# Altium schematic sheet M4QIDB-SCH-01 Master.SchDoc: <page title>
size Letter; Author: <XXX>; Organization: Engenuics Technologies Inc; Address1: 88 Dalhurst Way NW; Address2: CALGARY AB; Address3: CANADA T3A 1N7; Address4: 1-888-912-3451; DocumentNumber: <PPPP-DTTT->; Revision: <###>; SheetNumber: <x>; SheetTotal: <y>
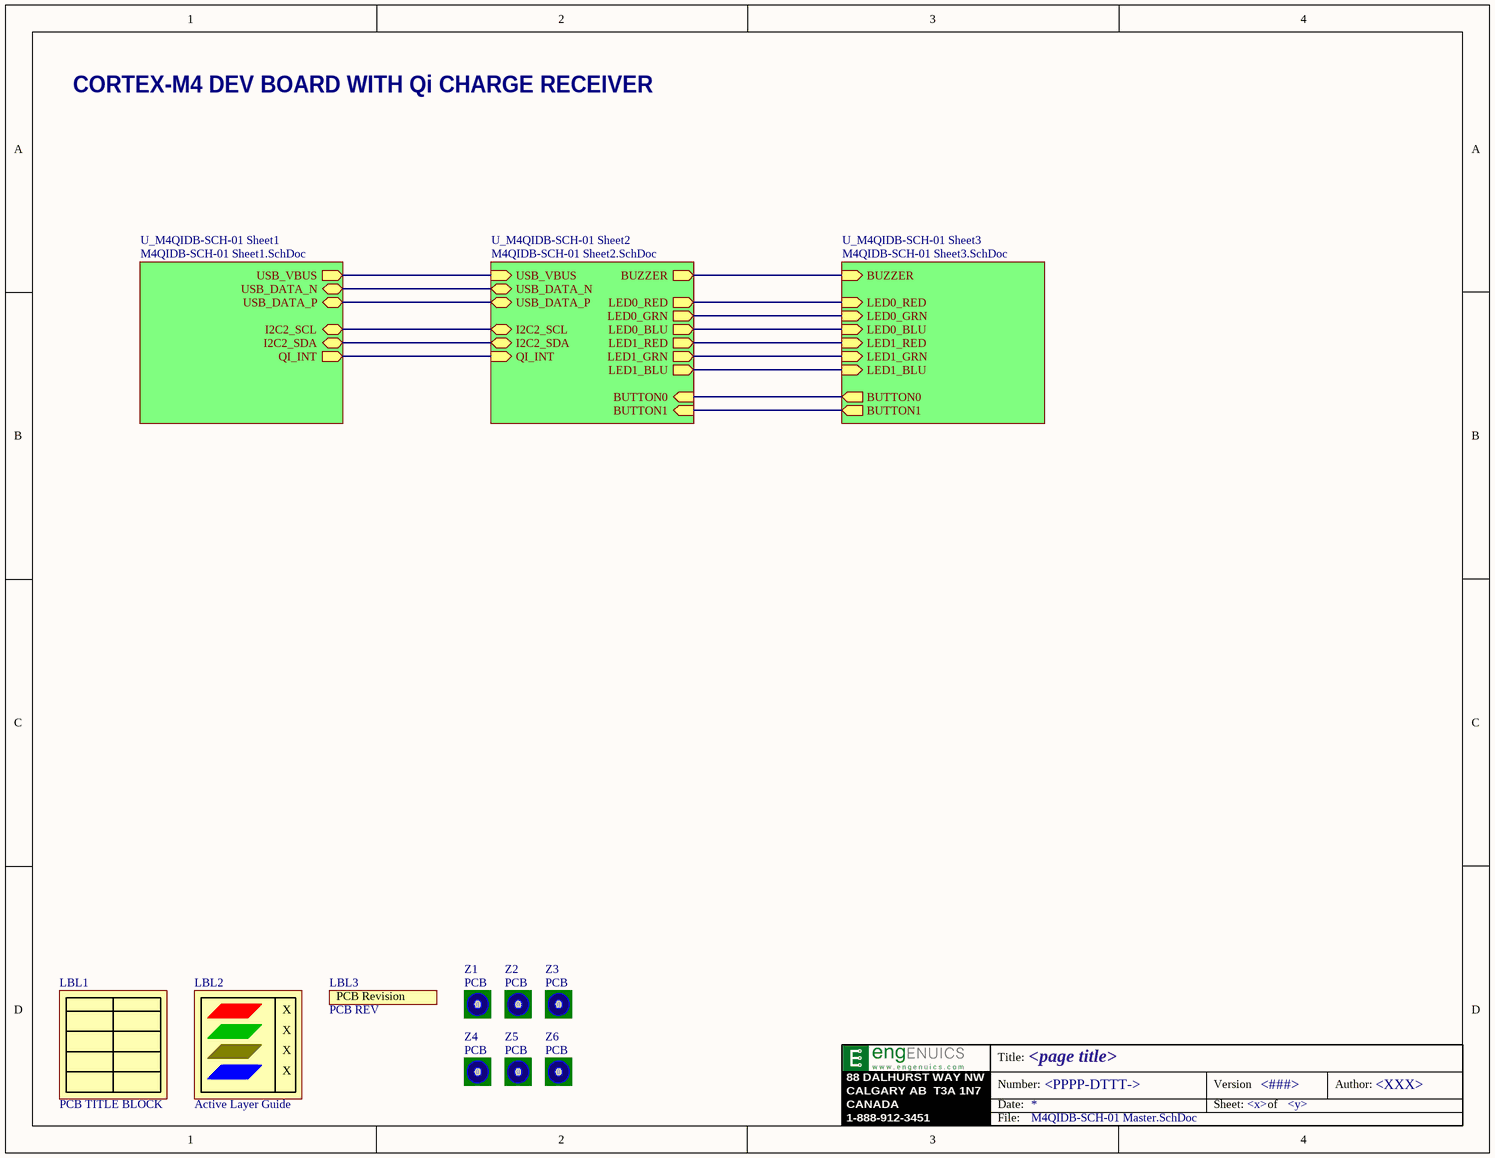
[diagram p0: M4QIDB-SCH-01 Master.SchDoc]

## Parts
LBL1  PCB TITLE BLOCK  [LABEL PCB Title Block]  (no BOM)
LBL2  Active Layer Guide  [LABEL PCB ACTIVE LAYERS VERTICAL]  (no BOM)
LBL3  PCB REV  [LABEL PCB REVISION]  (no BOM)
Z1  PCB  [FIDUCIAL PCB]  (no BOM)
Z2  PCB  [FIDUCIAL PCB]  (no BOM)
Z3  PCB  [FIDUCIAL PCB]  (no BOM)
Z4  PCB  [FIDUCIAL PCB]  (no BOM)
Z5  PCB  [FIDUCIAL PCB]  (no BOM)
Z6  PCB  [FIDUCIAL PCB]  (no BOM)

## Sub-sheets
U_M4QIDB-SCH-01 Sheet1 = M4QIDB-SCH-01 Sheet1.SchDoc: USB_DATA_N (bidir), USB_DATA_P (bidir), USB_VBUS (out), I2C2_SCL (bidir), I2C2_SDA (bidir), QI_INT (out)
U_M4QIDB-SCH-01 Sheet2 = M4QIDB-SCH-01 Sheet2.SchDoc: USB_DATA_N (bidir), USB_DATA_P (bidir), USB_VBUS (in), BUZZER (out), BUTTON0 (in), BUTTON1 (in), LED0_RED (out), LED1_RED (out), LED0_BLU (out), LED1_BLU (out), LED0_GRN (out), LED1_GRN (out), I2C2_SCL (bidir), I2C2_SDA (bidir), QI_INT (in)
U_M4QIDB-SCH-01 Sheet3 = M4QIDB-SCH-01 Sheet3.SchDoc: BUTTON1 (out), BUTTON0 (out), LED0_RED (in), LED1_RED (in), LED0_BLU (in), LED1_BLU (in), LED0_GRN (in), LED1_GRN (in), BUZZER (in)

## Nets
(unnamed): sheet U_M4QIDB-SCH-01 Sheet1/USB_DATA_N, sheet U_M4QIDB-SCH-01 Sheet2/USB_DATA_N
(unnamed): sheet U_M4QIDB-SCH-01 Sheet1/USB_DATA_P, sheet U_M4QIDB-SCH-01 Sheet2/USB_DATA_P
(unnamed): sheet U_M4QIDB-SCH-01 Sheet1/USB_VBUS, sheet U_M4QIDB-SCH-01 Sheet2/USB_VBUS
(unnamed): sheet U_M4QIDB-SCH-01 Sheet1/I2C2_SCL, sheet U_M4QIDB-SCH-01 Sheet2/I2C2_SCL
(unnamed): sheet U_M4QIDB-SCH-01 Sheet1/I2C2_SDA, sheet U_M4QIDB-SCH-01 Sheet2/I2C2_SDA
(unnamed): sheet U_M4QIDB-SCH-01 Sheet1/QI_INT, sheet U_M4QIDB-SCH-01 Sheet2/QI_INT
(unnamed): sheet U_M4QIDB-SCH-01 Sheet2/BUZZER, sheet U_M4QIDB-SCH-01 Sheet3/BUZZER
(unnamed): sheet U_M4QIDB-SCH-01 Sheet2/BUTTON0, sheet U_M4QIDB-SCH-01 Sheet3/BUTTON0
(unnamed): sheet U_M4QIDB-SCH-01 Sheet2/BUTTON1, sheet U_M4QIDB-SCH-01 Sheet3/BUTTON1
(unnamed): sheet U_M4QIDB-SCH-01 Sheet2/LED0_RED, sheet U_M4QIDB-SCH-01 Sheet3/LED0_RED
(unnamed): sheet U_M4QIDB-SCH-01 Sheet2/LED1_RED, sheet U_M4QIDB-SCH-01 Sheet3/LED1_RED
(unnamed): sheet U_M4QIDB-SCH-01 Sheet2/LED0_BLU, sheet U_M4QIDB-SCH-01 Sheet3/LED0_BLU
(unnamed): sheet U_M4QIDB-SCH-01 Sheet2/LED1_BLU, sheet U_M4QIDB-SCH-01 Sheet3/LED1_BLU
(unnamed): sheet U_M4QIDB-SCH-01 Sheet2/LED0_GRN, sheet U_M4QIDB-SCH-01 Sheet3/LED0_GRN
(unnamed): sheet U_M4QIDB-SCH-01 Sheet2/LED1_GRN, sheet U_M4QIDB-SCH-01 Sheet3/LED1_GRN

## Notes on the sheet
- CORTEX-M4 DEV BOARD WITH Qi CHARGE RECEIVER
- 88 DALHURST WAY NW
- CALGARY AB  T3A 1N7
- CANADA
- Title:
- Number:
- Date:
- Version
- Sheet:
- of
- Author:
- 1-888-912-3451
- File:
- (in symbol LABEL PCB ACTIVE LAYERS) X
- (in symbol LABEL PCB REVISION) PCB Revision

## Library data of the parts
LBL1 = LABEL PCB TITLE BLOCK: 1. Description: LABEL PCB TITLE BLOCK
LBL2 = LABEL PCB ACTIVE LAYERS: 1. Description: LABEL PCB ACTIVE LAYERS; 6. Last Modified: *; 7. Modified By: *
LBL3 = LABEL PCB REVISION: 1. Description: LABEL PCB ENGENUICS
Z1-Z6 = FIDUCIAL PCB: 1. Description: FIDUCIAL SINGLE LAYER PADS ONLY; 2. Manufacturer: *; 3. Manufacturer Part Number: *; 4. Digi-Key Part Number: *